# Altium schematic sheet Sheet1.SCHDOC
size 420 x 297 mm; SheetNumber: 1; SheetTotal: 1; DocumentName: Sheet1.SCHDOC
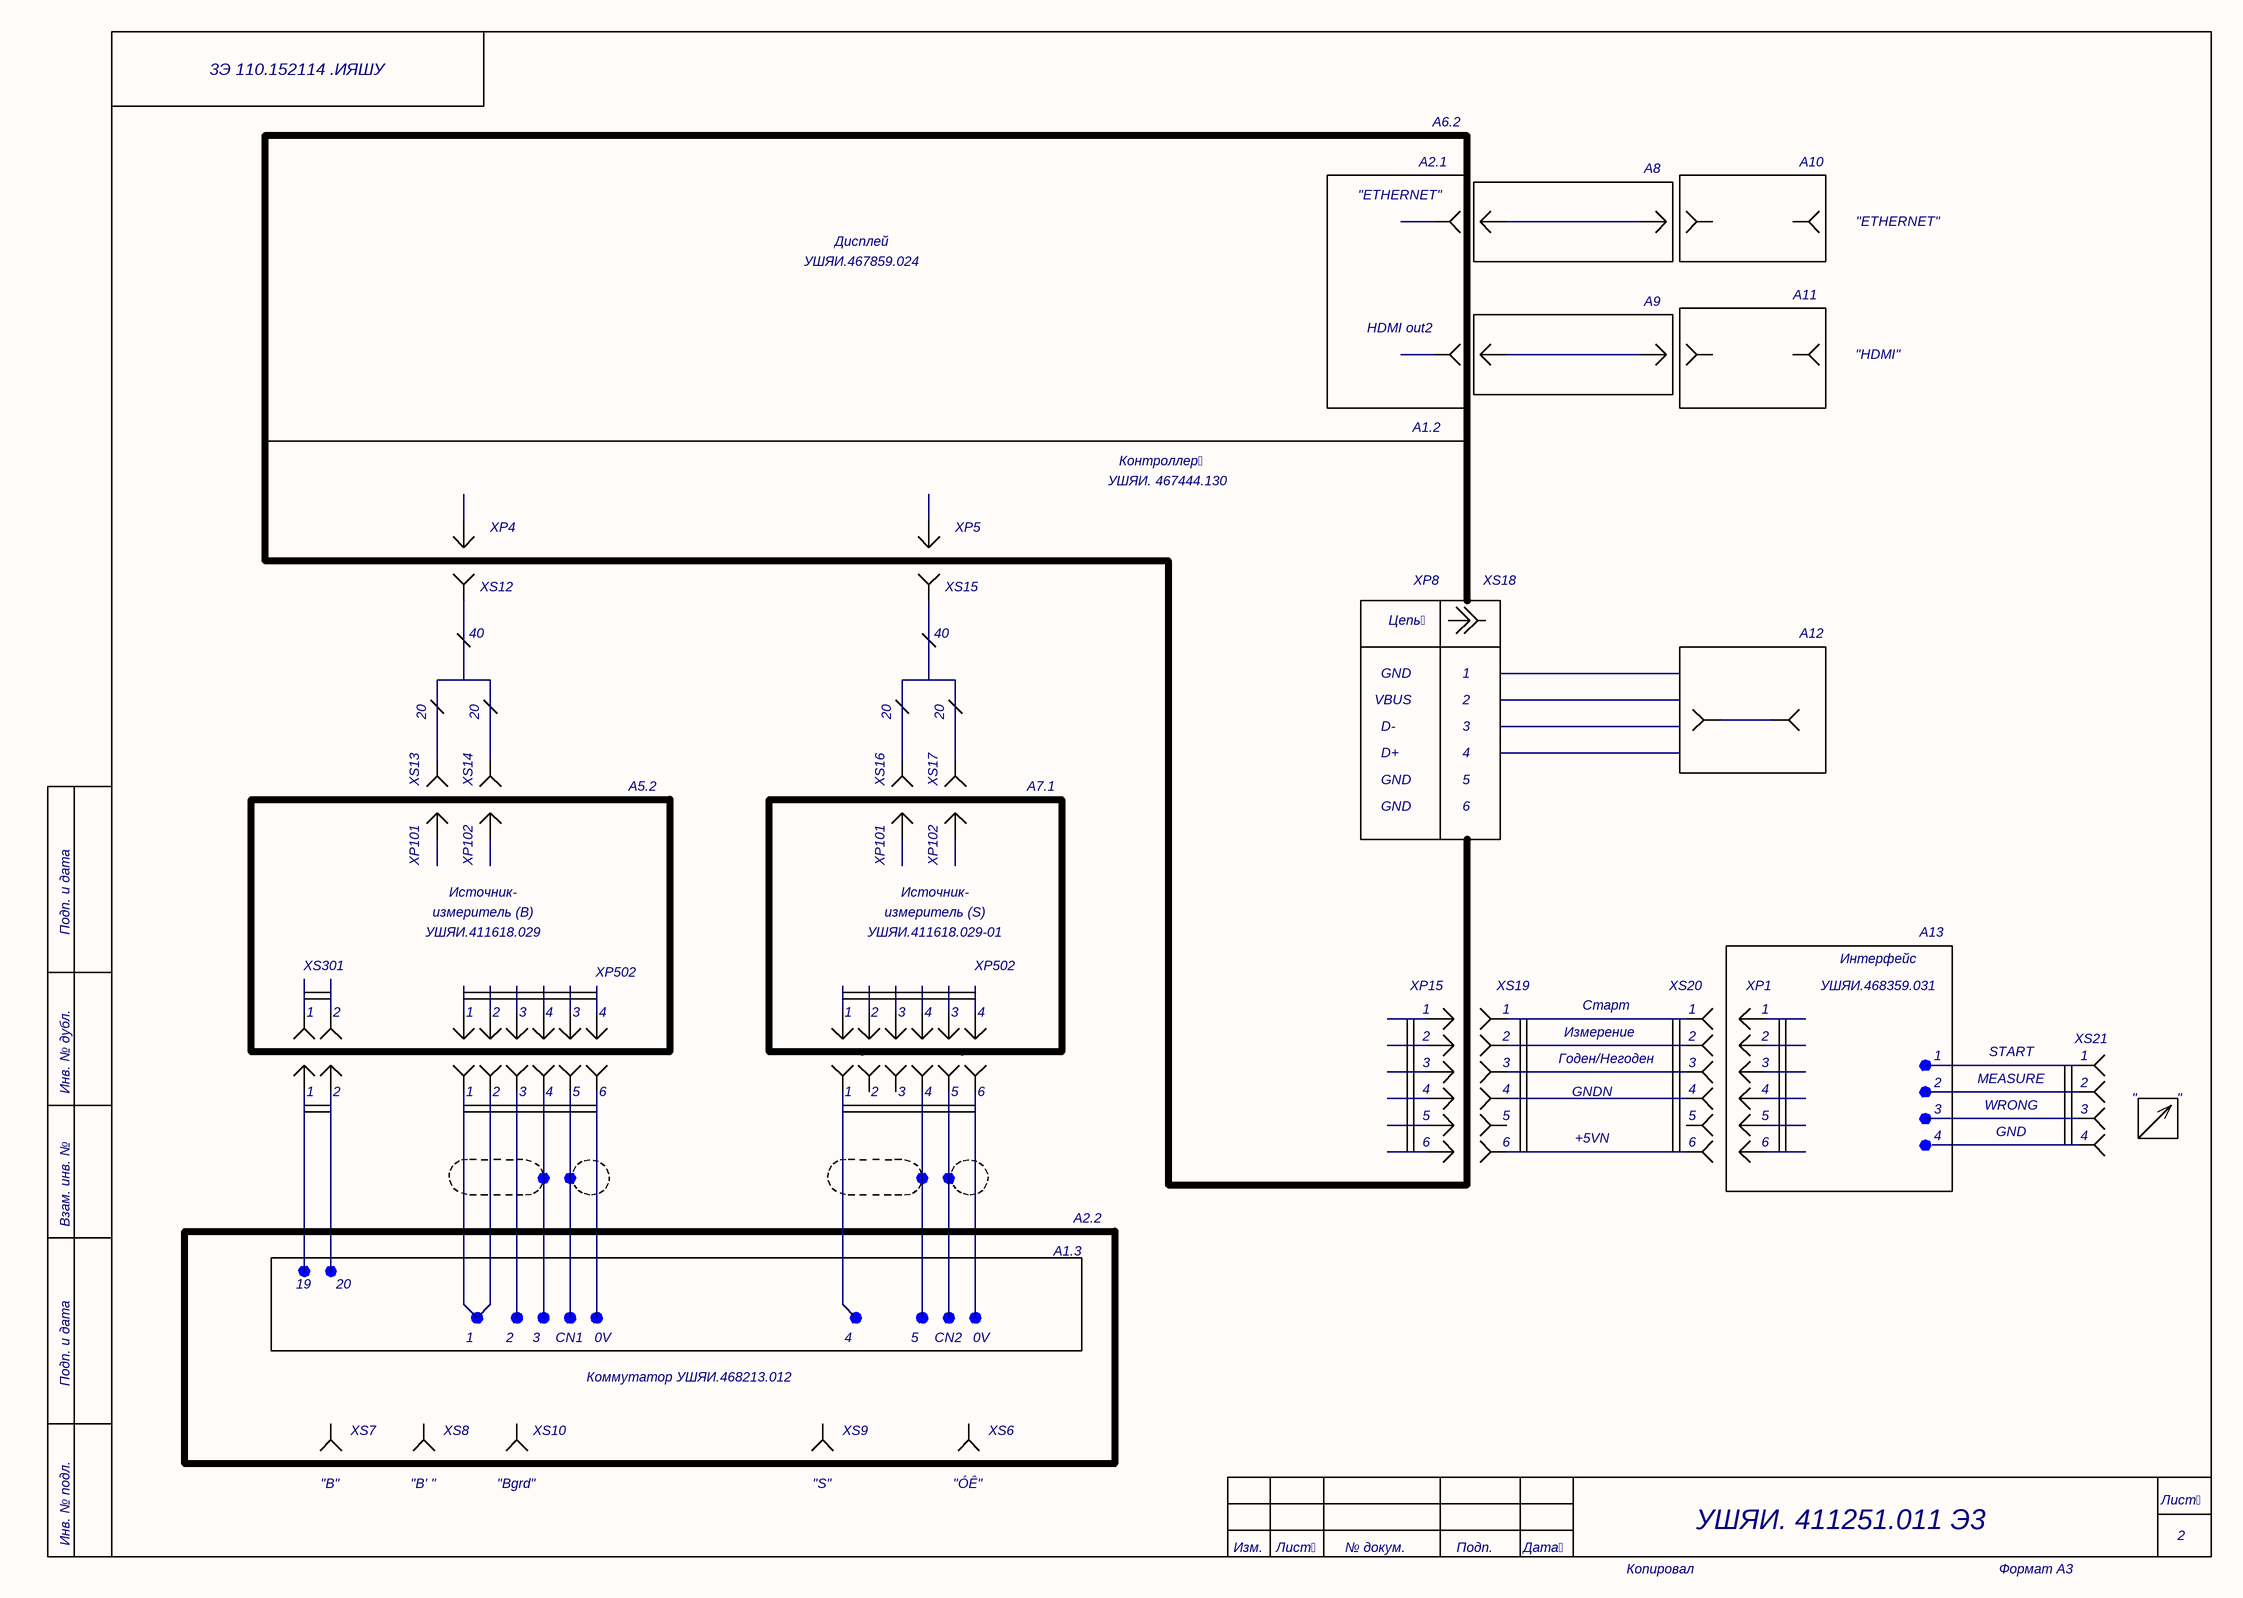
[diagram p0: Sheet1.SCHDOC]

## Parts
U7  PLUG  (value not drawn)
U8  PLUG  (value not drawn)
U40  SOCKET  (value not drawn)
U41  PLUG  (value not drawn)
U42  SOCKET  (value not drawn)
U43  SOCKET  (value not drawn)
U44  PLUG  (value not drawn)
U45  PLUG  (value not drawn)
U46  SOCKET  (value not drawn)
U47  PLUG  (value not drawn)
U50  SOCKET  (value not drawn)
U51  SOCKET  (value not drawn)
U52  SOCKET  (value not drawn)
U53  SOCKET  (value not drawn)
U54  PLUG  (value not drawn)
U55  PLUG  (value not drawn)
U56  PLUG  (value not drawn)
U57  SOCKET  (value not drawn)
U58  SOCKET  (value not drawn)
U59  SOCKET  (value not drawn)
U61  PLUG  (value not drawn)
U62  SOCKET  (value not drawn)
U63  SOCKET  (value not drawn)
U64  SOCKET  (value not drawn)
U65  SOCKET  (value not drawn)
U66  PLUG  (value not drawn)
U67  PLUG  (value not drawn)
U68  PLUG  (value not drawn)
U69  PLUG  (value not drawn)
U70  PLUG  (value not drawn)
U71  PLUG  (value not drawn)
U72  SOCKET  (value not drawn)
U73  SOCKET  (value not drawn)
U74  SOCKET  (value not drawn)
U75  SOCKET  (value not drawn)
U76  SOCKET  (value not drawn)
U77  SOCKET  (value not drawn)
U78  SOCKET  (value not drawn)
U79  PLUG  (value not drawn)
U80  PLUG  (value not drawn)
U81  SOCKET  (value not drawn)
U82  SOCKET  (value not drawn)
U83  SOCKET  (value not drawn)
U104  PLUG  (value not drawn)
U105  PLUG  (value not drawn)
U114  SOCKET  (value not drawn)
U115  SOCKET  (value not drawn)
U122  PLUG  (value not drawn)
U123  PLUG  (value not drawn)
U126  PLUG  (value not drawn)
U127  PLUG  (value not drawn)
U128  PLUG  (value not drawn)
U129  PLUG  (value not drawn)
U130  PLUG  (value not drawn)
U131  PLUG  (value not drawn)
U142  SOCKET  (value not drawn)
U143  SOCKET  (value not drawn)
U144  SOCKET  (value not drawn)
U145  SOCKET  (value not drawn)
U146  SOCKET  (value not drawn)
U147  SOCKET  (value not drawn)
U148  SOCKET  (value not drawn)
U149  SOCKET  (value not drawn)
U151  SOCKET  (value not drawn)
U152  SOCKET  (value not drawn)
U153  SOCKET  (value not drawn)
U154  PLUG  (value not drawn)
U155  SOCKET  (value not drawn)
U156  PLUG  (value not drawn)
U157  PLUG  (value not drawn)
U158  SOCKET  (value not drawn)
U159  PLUG  (value not drawn)
U160  SOCKET  (value not drawn)
U161  PLUG  (value not drawn)
U162  PLUG  (value not drawn)
U163  PLUG  (value not drawn)
U164  SOCKET  (value not drawn)
U165  SOCKET  (value not drawn)
U166  PLUG  (value not drawn)
XS3  SOCKET  (value not drawn)
XS4  SOCKET  (value not drawn)
XS9  SOCKET  (value not drawn)
XS11  SOCKET  (value not drawn)
XS14  SOCKET  (value not drawn)
XS15  SOCKET  (value not drawn)

## Blocks framed on the sheet
A8: U156 U157
A10: U57 U81
A11: U59 U83
A9: U163 U166
A12: U58 U82

## Nets
NetU40_1: U40.1 U46.1
NetU58_1: U58.1 U82.1
NetU142_1: U142.1 U143.1
NetU144_1: U144.1 U147.1
NetU145_1: U145.1 U148.1
NetU153_1: U153.1 U155.1
NetU156_1: U156.1 U157.1
NetU158_1: U158.1 U160.1
NetU163_1: U163.1 U166.1
NetXS3_1: XS3.1 XS9.1 XS14.1
NetXS4_1: XS4.1 XS11.1 XS15.1

Not connected (* = marked no-connect by the designer): U7 1; U8 1; U41 1; U42 1; U43 1; U44 1; U45 1; U47 1; U50 1; U51 1; U52 1; U53 1; U54 1; U55 1; U56 1; U57 1; U59 1; U61 1; U62 1; U63 1; U64 1; U65 1; U66 1; U67 1; U68 1; U69 1; U70 1; U71 1; U72 1; U73 1; U74 1; U75 1; U76 1; U77 1; U78 1; U79 1; U80 1; U81 1; U83 1; U104 1; U105 1; U114 1; U115 1; U122 1; U123 1; U126 1; U127 1; U128 1; U129 1; U130 1; U131 1; U146 1; U149 1; U151 1; U152 1; U154 1; U159 1; U161 1; U162 1; U164 1; U165 1

## Notes on the sheet
- 3Э 110.152114 .ИЯШУ
- A6.2
- (near U114) "ETHERNET"
- A2.1
- УШЯИ.467859.024
- Дисплей
- "ETHERNET"
- (near U115) HDMI out2
- (near U59) "HDMI"
- Контроллер
- A1.2
- (near U70) XP4
- (near U71) XP5
- УШЯИ. 467444.130
- (near XS9) XS12
- (near XS11) XS15
- XP8
- XS18
- (near XS9) 40
- (near XS11) 40
- Цепь
- 20
- VBUS
- GND
- D-
- 1
- 3
- 2
- (near XS3) XS13
- (near XS14) XS14
- A5.2
- (near XS4) XS16
- (near XS15) XS17
- A7.1
- D+
- 4
- 5
- 6
- (near U7) XP101
- XP102
- (near U8) XP101
- Подп. и дата
- измеритель (B)
- УШЯИ.411618.029
- Источник-
- измеритель (S)
- УШЯИ.411618.029-01
- A13
- XS301
- XP502
- (near U126) 1
- (near U126) XP15
- (near U142) 1
- (near U142) XS19
- Старт
- (near U143) XS20
- (near U143) 1
- (near U161) XP1
- (near U161) 1
- Интерфейс
- УШЯИ.468359.031
- (near U51) 1
- (near U50) 2
- (near U41) 1
- (near U47) 2
- (near U44) 3
- (near U45) 4
- (near U61) 3
- (near U55) 4
- (near U66) 1
- (near U79) 2
- (near U67) 3
- (near U68) 4
- (near U80) 3
- (near U69) 4
- Измерение
- Годен/Негоден
- START
- (near U165) 1
- (near U165) XS21
- Инв. № дубл.
- (near U56) 1
- (near U54) 2
- (near U40) 1
- (near U46) 2
- (near U42) 3
- (near U43) 4
- (near U53) 5
- (near U52) 6
- (near U62) 1
- (near U72) 2
- (near U63) 3
- (near U64) 4
- (near U78) 5
- (near U65) 6
- GNDN
- +5VN
- WRONG
- MEASURE
- "          "
- Взам. инв. №
- A1.3
- A2.2
- 19
- CN1
- 0V
- CN2
- Коммутатор УШЯИ.468213.012
- (near U73) XS7
- (near U74) XS8
- (near U75) XS10
- (near U76) XS9
- (near U77) XS6
- Инв. № подл.
- (near U73) "B"
- (near U74) "B' "
- (near U75) "Bgrd"
- (near U76) "S"
- (near U77) "ÓÊ"
- УШЯИ. 411251.011 Э3
- Лист
- Изм.
- № докум.
- Подп.
- Дата
- Копировал
- Формат А3

## Library data of the parts
U7 U8 U41 U44 U45 U47 U54-U56 U61 U66-U71 U79 U80 U104 U105 U122 U123 U126-U131 U154 U156 U157 U159 U161-U163 U166 = PLUG: Value: *
U40 U42 U43 U46 U50-U53 U57-U59 U62-U65 U72-U78 U81-U83 U114 U115 U142-U149 U151-U153 U155 U158 U160 U164 U165 XS3 XS4 XS9 XS11 XS14 XS15 = SOCKET: Value: *